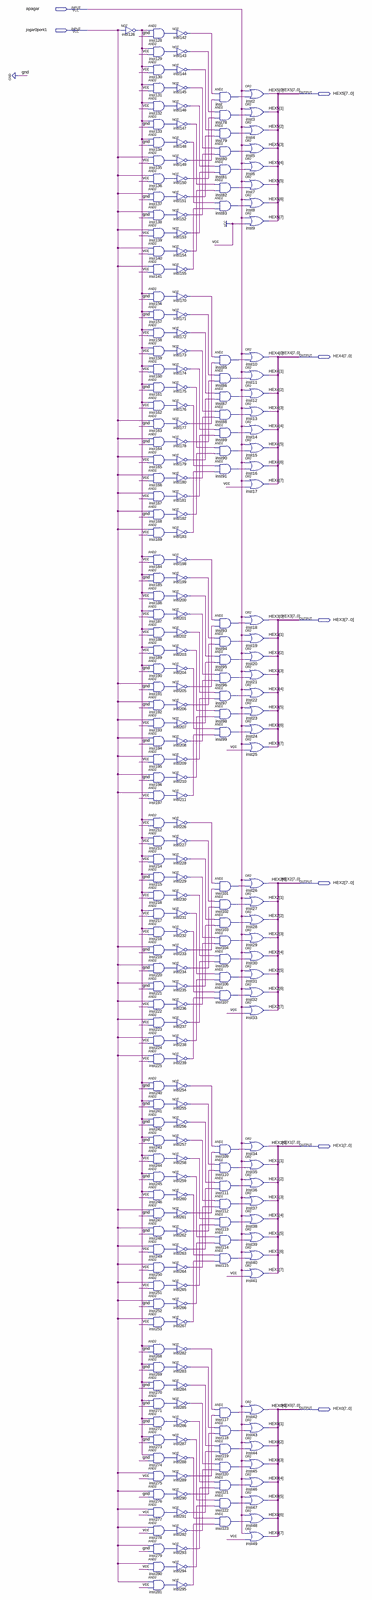
[diagram p0: schematic sheet, whole]
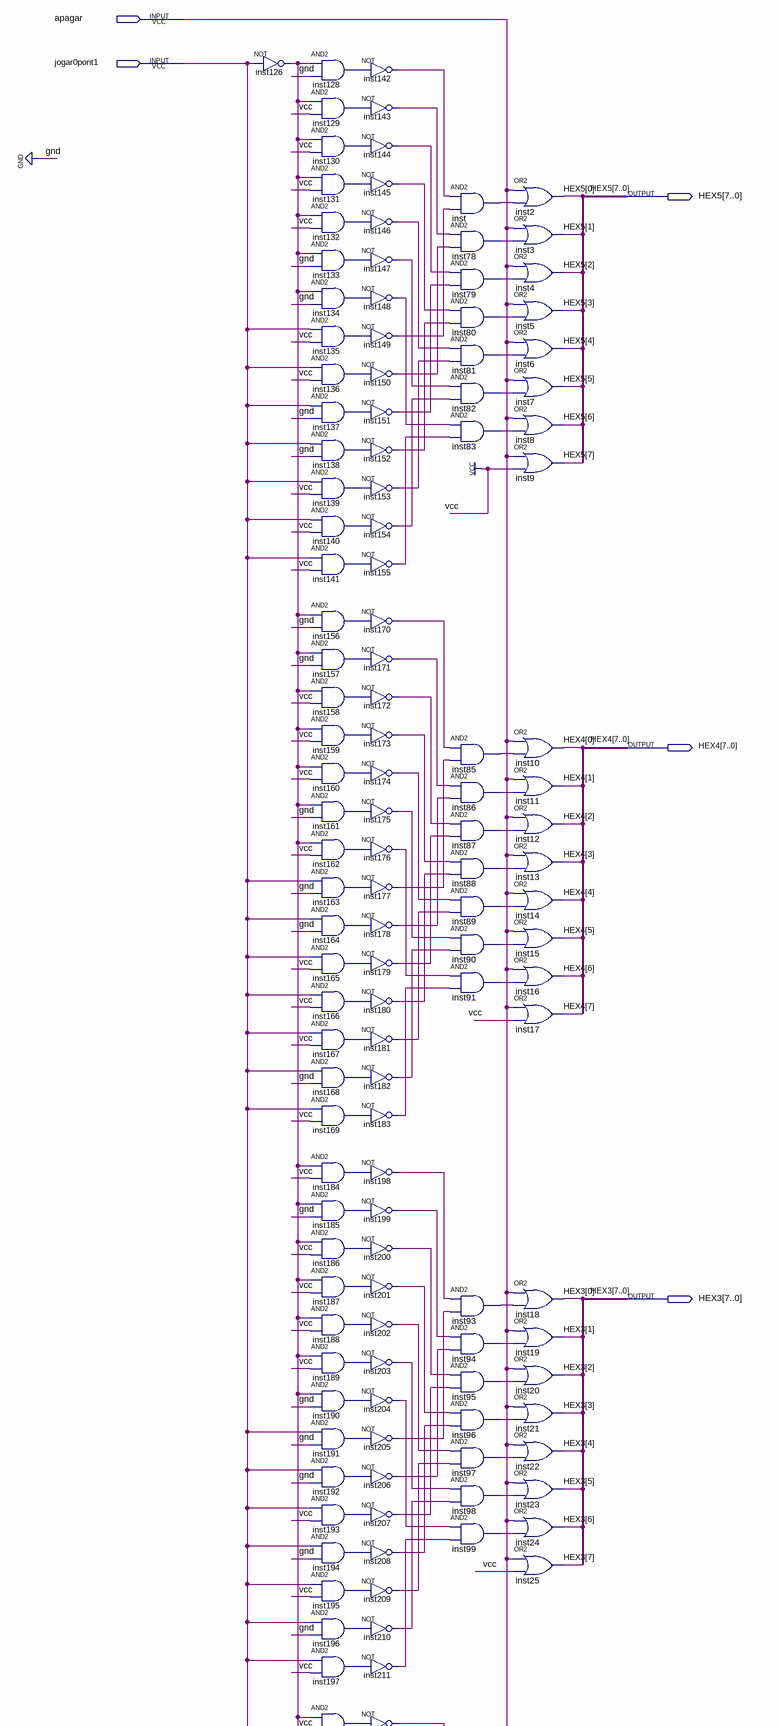
[diagram p1: schematic sheet, upper part]
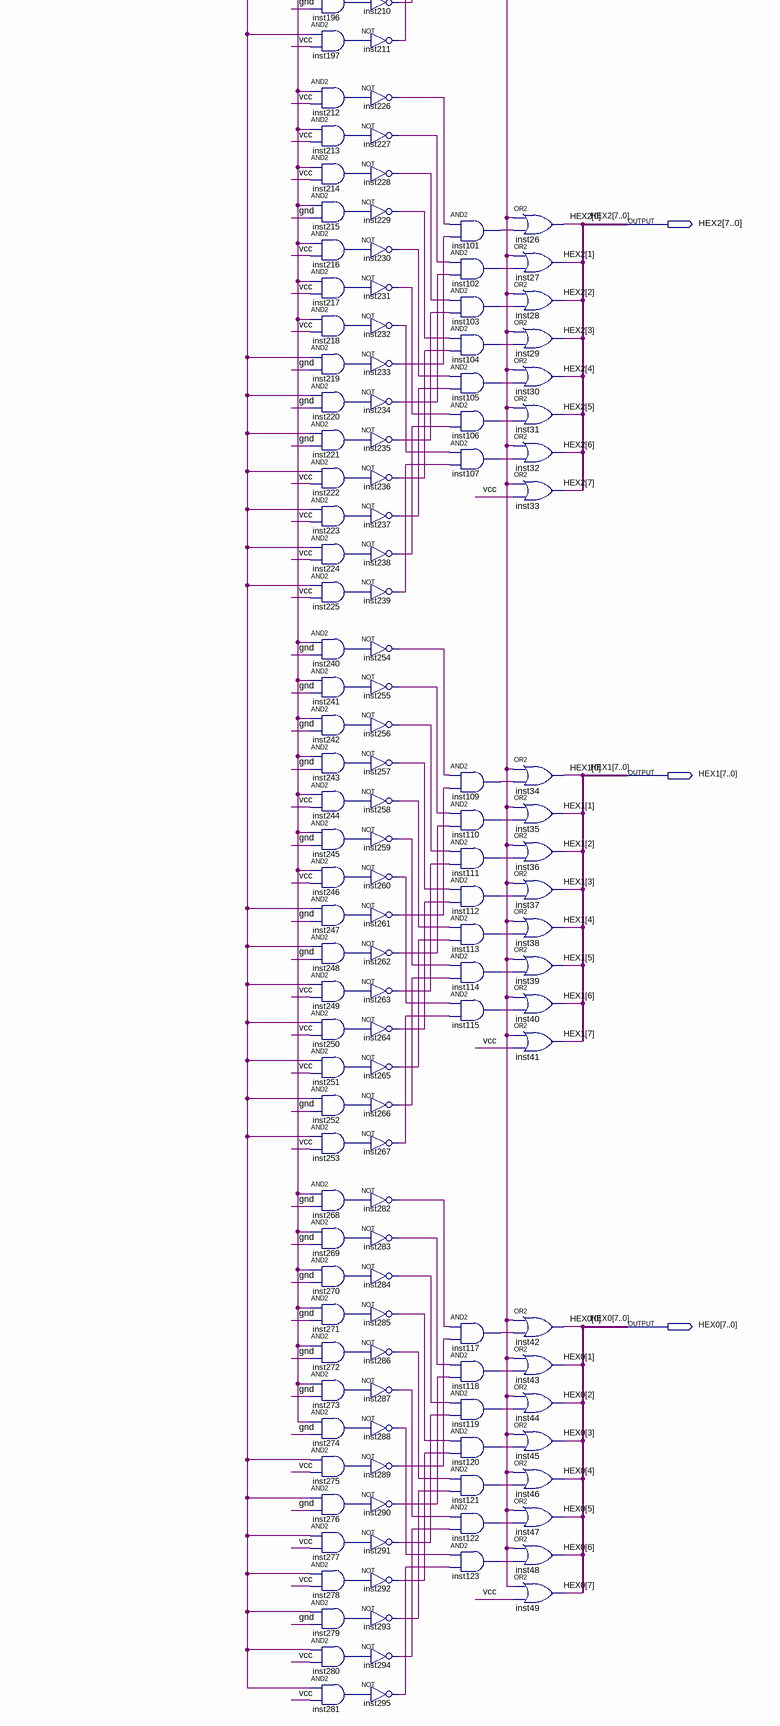
[diagram p2: schematic sheet, lower part]
// Quartus schematic displaymenu.bdf as structural Verilog: 259 symbols, 8 pins
module displaymenu (
  input  apagar,
  input  jogar0pont1,
  output [7:0] HEX5,
  output [7:0] HEX4,
  output [7:0] HEX3,
  output [7:0] HEX2,
  output [7:0] HEX1,
  output [7:0] HEX0
);

  wire inst78_out, inst79_out, inst80_out, inst81_out, inst82_out, inst83_out, inst85_out, inst86_out,
       inst87_out, inst88_out, inst89_out, inst90_out, inst91_out, inst93_out, inst94_out, inst95_out,
       inst96_out, inst97_out, inst98_out, inst99_out, inst101_out, inst102_out, inst103_out, inst104_out,
       inst105_out, inst106_out, inst107_out, inst109_out, inst110_out, inst111_out, inst112_out,
       inst113_out, inst114_out, inst115_out, inst117_out, inst118_out, inst119_out, inst120_out,
       inst121_out, inst122_out, inst123_out, inst126_out, inst128_out, inst129_out, inst130_out,
       inst131_out, inst132_out, inst133_out, inst134_out, inst135_out, inst136_out, inst137_out,
       inst138_out, inst139_out, inst140_out, inst141_out, inst142_out, inst143_out, inst144_out,
       inst145_out, inst146_out, inst147_out, inst148_out, inst149_out, inst150_out, inst151_out,
       inst152_out, inst153_out, inst154_out, inst155_out, inst156_out, inst157_out, inst158_out,
       inst159_out, inst160_out, inst161_out, inst162_out, inst163_out, inst164_out, inst165_out,
       inst166_out, inst167_out, inst168_out, inst169_out, inst170_out, inst171_out, inst172_out,
       inst173_out, inst174_out, inst175_out, inst176_out, inst177_out, inst178_out, inst179_out,
       inst180_out, inst181_out, inst182_out, inst183_out, inst184_out, inst185_out, inst186_out,
       inst187_out, inst188_out, inst189_out, inst190_out, inst191_out, inst192_out, inst193_out,
       inst194_out, inst195_out, inst196_out, inst197_out, inst198_out, inst199_out, inst200_out,
       inst201_out, inst202_out, inst203_out, inst204_out, inst205_out, inst206_out, inst207_out,
       inst208_out, inst209_out, inst210_out, inst211_out, inst212_out, inst213_out, inst214_out,
       inst215_out, inst216_out, inst217_out, inst218_out, inst219_out, inst220_out, inst221_out,
       inst222_out, inst223_out, inst224_out, inst225_out, inst226_out, inst227_out, inst228_out,
       inst229_out, inst230_out, inst231_out, inst232_out, inst233_out, inst234_out, inst235_out,
       inst236_out, inst237_out, inst238_out, inst239_out, inst240_out, inst241_out, inst242_out,
       inst243_out, inst244_out, inst245_out, inst246_out, inst247_out, inst248_out, inst249_out,
       inst250_out, inst251_out, inst252_out, inst253_out, inst254_out, inst255_out, inst256_out,
       inst257_out, inst258_out, inst259_out, inst260_out, inst261_out, inst262_out, inst263_out,
       inst264_out, inst265_out, inst266_out, inst267_out, inst268_out, inst269_out, inst270_out,
       inst271_out, inst272_out, inst273_out, inst274_out, inst275_out, inst276_out, inst277_out,
       inst278_out, inst279_out, inst280_out, inst281_out, inst282_out, inst283_out, inst284_out,
       inst285_out, inst286_out, inst287_out, inst288_out, inst289_out, inst290_out, inst291_out,
       inst292_out, inst293_out, inst294_out, inst295_out, inst_out;

  not inst126 (inst126_out, jogar0pont1);
  and inst128 (inst128_out, inst126_out, 1'b0);
  and inst129 (inst129_out, inst126_out, 1'b1);
  and inst130 (inst130_out, inst126_out, 1'b1);
  and inst131 (inst131_out, inst126_out, 1'b1);
  and inst132 (inst132_out, inst126_out, 1'b1);
  and inst133 (inst133_out, inst126_out, 1'b0);
  and inst134 (inst134_out, inst126_out, 1'b0);
  and inst135 (inst135_out, jogar0pont1, 1'b1);
  and inst136 (inst136_out, jogar0pont1, 1'b1);
  and inst137 (inst137_out, jogar0pont1, 1'b0);
  and inst138 (inst138_out, jogar0pont1, 1'b0);
  and inst139 (inst139_out, jogar0pont1, 1'b1);
  and inst140 (inst140_out, jogar0pont1, 1'b1);
  and inst141 (inst141_out, jogar0pont1, 1'b1);
  and inst156 (inst156_out, inst126_out, 1'b0);
  and inst157 (inst157_out, inst126_out, 1'b0);
  and inst158 (inst158_out, inst126_out, 1'b1);
  and inst159 (inst159_out, inst126_out, 1'b1);
  and inst160 (inst160_out, inst126_out, 1'b1);
  and inst161 (inst161_out, inst126_out, 1'b0);
  and inst162 (inst162_out, inst126_out, 1'b1);
  and inst163 (inst163_out, jogar0pont1, 1'b0);
  and inst164 (inst164_out, jogar0pont1, 1'b0);
  and inst165 (inst165_out, jogar0pont1, 1'b1);
  and inst166 (inst166_out, jogar0pont1, 1'b1);
  and inst167 (inst167_out, jogar0pont1, 1'b1);
  and inst168 (inst168_out, jogar0pont1, 1'b0);
  and inst169 (inst169_out, jogar0pont1, 1'b1);
  and inst184 (inst184_out, inst126_out, 1'b1);
  and inst185 (inst185_out, inst126_out, 1'b0);
  and inst186 (inst186_out, inst126_out, 1'b1);
  and inst187 (inst187_out, inst126_out, 1'b1);
  and inst188 (inst188_out, inst126_out, 1'b1);
  and inst189 (inst189_out, inst126_out, 1'b1);
  and inst190 (inst190_out, inst126_out, 1'b0);
  and inst191 (inst191_out, jogar0pont1, 1'b0);
  and inst192 (inst192_out, jogar0pont1, 1'b0);
  and inst193 (inst193_out, jogar0pont1, 1'b1);
  and inst194 (inst194_out, jogar0pont1, 1'b0);
  and inst195 (inst195_out, jogar0pont1, 1'b1);
  and inst196 (inst196_out, jogar0pont1, 1'b0);
  and inst197 (inst197_out, jogar0pont1, 1'b1);
  and inst212 (inst212_out, inst126_out, 1'b1);
  and inst213 (inst213_out, inst126_out, 1'b1);
  and inst214 (inst214_out, inst126_out, 1'b1);
  and inst215 (inst215_out, inst126_out, 1'b0);
  and inst216 (inst216_out, inst126_out, 1'b1);
  and inst217 (inst217_out, inst126_out, 1'b1);
  and inst218 (inst218_out, inst126_out, 1'b1);
  and inst219 (inst219_out, jogar0pont1, 1'b0);
  and inst220 (inst220_out, jogar0pont1, 1'b0);
  and inst221 (inst221_out, jogar0pont1, 1'b0);
  and inst222 (inst222_out, jogar0pont1, 1'b1);
  and inst223 (inst223_out, jogar0pont1, 1'b1);
  and inst224 (inst224_out, jogar0pont1, 1'b1);
  and inst225 (inst225_out, jogar0pont1, 1'b1);
  and inst240 (inst240_out, inst126_out, 1'b0);
  and inst241 (inst241_out, inst126_out, 1'b0);
  and inst242 (inst242_out, inst126_out, 1'b0);
  and inst243 (inst243_out, inst126_out, 1'b0);
  and inst244 (inst244_out, inst126_out, 1'b1);
  and inst245 (inst245_out, inst126_out, 1'b0);
  and inst246 (inst246_out, inst126_out, 1'b1);
  and inst247 (inst247_out, jogar0pont1, 1'b0);
  and inst248 (inst248_out, jogar0pont1, 1'b0);
  and inst249 (inst249_out, jogar0pont1, 1'b1);
  and inst250 (inst250_out, jogar0pont1, 1'b1);
  and inst251 (inst251_out, jogar0pont1, 1'b1);
  and inst252 (inst252_out, jogar0pont1, 1'b0);
  and inst253 (inst253_out, jogar0pont1, 1'b1);
  and inst268 (inst268_out, inst126_out, 1'b0);
  and inst269 (inst269_out, inst126_out, 1'b0);
  and inst270 (inst270_out, inst126_out, 1'b0);
  and inst271 (inst271_out, inst126_out, 1'b0);
  and inst272 (inst272_out, inst126_out, 1'b0);
  and inst273 (inst273_out, inst126_out, 1'b0);
  and inst274 (inst274_out, inst126_out, 1'b0);
  and inst275 (inst275_out, jogar0pont1, 1'b1);
  and inst276 (inst276_out, jogar0pont1, 1'b0);
  and inst277 (inst277_out, jogar0pont1, 1'b1);
  and inst278 (inst278_out, jogar0pont1, 1'b1);
  and inst279 (inst279_out, jogar0pont1, 1'b0);
  and inst280 (inst280_out, jogar0pont1, 1'b1);
  and inst281 (inst281_out, jogar0pont1, 1'b1);
  not inst142 (inst142_out, inst128_out);
  not inst143 (inst143_out, inst129_out);
  not inst144 (inst144_out, inst130_out);
  not inst145 (inst145_out, inst131_out);
  not inst146 (inst146_out, inst132_out);
  not inst147 (inst147_out, inst133_out);
  not inst148 (inst148_out, inst134_out);
  not inst149 (inst149_out, inst135_out);
  not inst150 (inst150_out, inst136_out);
  not inst151 (inst151_out, inst137_out);
  not inst152 (inst152_out, inst138_out);
  not inst153 (inst153_out, inst139_out);
  not inst154 (inst154_out, inst140_out);
  not inst155 (inst155_out, inst141_out);
  not inst170 (inst170_out, inst156_out);
  not inst171 (inst171_out, inst157_out);
  not inst172 (inst172_out, inst158_out);
  not inst173 (inst173_out, inst159_out);
  not inst174 (inst174_out, inst160_out);
  not inst175 (inst175_out, inst161_out);
  not inst176 (inst176_out, inst162_out);
  not inst177 (inst177_out, inst163_out);
  not inst178 (inst178_out, inst164_out);
  not inst179 (inst179_out, inst165_out);
  not inst180 (inst180_out, inst166_out);
  not inst181 (inst181_out, inst167_out);
  not inst182 (inst182_out, inst168_out);
  not inst183 (inst183_out, inst169_out);
  not inst198 (inst198_out, inst184_out);
  not inst199 (inst199_out, inst185_out);
  not inst200 (inst200_out, inst186_out);
  not inst201 (inst201_out, inst187_out);
  not inst202 (inst202_out, inst188_out);
  not inst203 (inst203_out, inst189_out);
  not inst204 (inst204_out, inst190_out);
  not inst205 (inst205_out, inst191_out);
  not inst206 (inst206_out, inst192_out);
  not inst207 (inst207_out, inst193_out);
  not inst208 (inst208_out, inst194_out);
  not inst209 (inst209_out, inst195_out);
  not inst210 (inst210_out, inst196_out);
  not inst211 (inst211_out, inst197_out);
  not inst226 (inst226_out, inst212_out);
  not inst227 (inst227_out, inst213_out);
  not inst228 (inst228_out, inst214_out);
  not inst229 (inst229_out, inst215_out);
  not inst230 (inst230_out, inst216_out);
  not inst231 (inst231_out, inst217_out);
  not inst232 (inst232_out, inst218_out);
  not inst233 (inst233_out, inst219_out);
  not inst234 (inst234_out, inst220_out);
  not inst235 (inst235_out, inst221_out);
  not inst236 (inst236_out, inst222_out);
  not inst237 (inst237_out, inst223_out);
  not inst238 (inst238_out, inst224_out);
  not inst239 (inst239_out, inst225_out);
  not inst254 (inst254_out, inst240_out);
  not inst255 (inst255_out, inst241_out);
  not inst256 (inst256_out, inst242_out);
  not inst257 (inst257_out, inst243_out);
  not inst258 (inst258_out, inst244_out);
  not inst259 (inst259_out, inst245_out);
  not inst260 (inst260_out, inst246_out);
  not inst261 (inst261_out, inst247_out);
  not inst262 (inst262_out, inst248_out);
  not inst263 (inst263_out, inst249_out);
  not inst264 (inst264_out, inst250_out);
  not inst265 (inst265_out, inst251_out);
  not inst266 (inst266_out, inst252_out);
  not inst267 (inst267_out, inst253_out);
  not inst282 (inst282_out, inst268_out);
  not inst283 (inst283_out, inst269_out);
  not inst284 (inst284_out, inst270_out);
  not inst285 (inst285_out, inst271_out);
  not inst286 (inst286_out, inst272_out);
  not inst287 (inst287_out, inst273_out);
  not inst288 (inst288_out, inst274_out);
  not inst289 (inst289_out, inst275_out);
  not inst290 (inst290_out, inst276_out);
  not inst291 (inst291_out, inst277_out);
  not inst292 (inst292_out, inst278_out);
  not inst293 (inst293_out, inst279_out);
  not inst294 (inst294_out, inst280_out);
  not inst295 (inst295_out, inst281_out);
  and inst (inst_out, inst142_out, inst149_out);
  and inst78 (inst78_out, inst143_out, inst150_out);
  and inst79 (inst79_out, inst144_out, inst151_out);
  and inst80 (inst80_out, inst145_out, inst152_out);
  and inst81 (inst81_out, inst146_out, inst153_out);
  and inst82 (inst82_out, inst147_out, inst154_out);
  and inst83 (inst83_out, inst148_out, inst155_out);
  and inst85 (inst85_out, inst170_out, inst177_out);
  and inst86 (inst86_out, inst171_out, inst178_out);
  and inst87 (inst87_out, inst172_out, inst179_out);
  and inst88 (inst88_out, inst173_out, inst180_out);
  and inst89 (inst89_out, inst174_out, inst181_out);
  and inst90 (inst90_out, inst175_out, inst182_out);
  and inst91 (inst91_out, inst176_out, inst183_out);
  and inst93 (inst93_out, inst198_out, inst205_out);
  and inst94 (inst94_out, inst199_out, inst206_out);
  and inst95 (inst95_out, inst200_out, inst207_out);
  and inst96 (inst96_out, inst201_out, inst208_out);
  and inst97 (inst97_out, inst202_out, inst209_out);
  and inst98 (inst98_out, inst203_out, inst210_out);
  and inst99 (inst99_out, inst204_out, inst211_out);
  and inst101 (inst101_out, inst226_out, inst233_out);
  and inst102 (inst102_out, inst227_out, inst234_out);
  and inst103 (inst103_out, inst228_out, inst235_out);
  and inst104 (inst104_out, inst229_out, inst236_out);
  and inst105 (inst105_out, inst230_out, inst237_out);
  and inst106 (inst106_out, inst231_out, inst238_out);
  and inst107 (inst107_out, inst232_out, inst239_out);
  and inst109 (inst109_out, inst254_out, inst261_out);
  and inst110 (inst110_out, inst255_out, inst262_out);
  and inst111 (inst111_out, inst256_out, inst263_out);
  and inst112 (inst112_out, inst257_out, inst264_out);
  and inst113 (inst113_out, inst258_out, inst265_out);
  and inst114 (inst114_out, inst259_out, inst266_out);
  and inst115 (inst115_out, inst260_out, inst267_out);
  and inst117 (inst117_out, inst282_out, inst289_out);
  and inst118 (inst118_out, inst283_out, inst290_out);
  and inst119 (inst119_out, inst284_out, inst291_out);
  and inst120 (inst120_out, inst285_out, inst292_out);
  and inst121 (inst121_out, inst286_out, inst293_out);
  and inst122 (inst122_out, inst287_out, inst294_out);
  and inst123 (inst123_out, inst288_out, inst295_out);
  or inst2 (HEX5[0], apagar, inst_out);
  or inst3 (HEX5[1], apagar, inst78_out);
  or inst4 (HEX5[2], apagar, inst79_out);
  or inst5 (HEX5[3], apagar, inst80_out);
  or inst6 (HEX5[4], apagar, inst81_out);
  or inst7 (HEX5[5], apagar, inst82_out);
  or inst8 (HEX5[6], apagar, inst83_out);
  or inst9 (HEX5[7], apagar, 1'b1);
  or inst10 (HEX4[0], apagar, inst85_out);
  or inst11 (HEX4[1], apagar, inst86_out);
  or inst12 (HEX4[2], apagar, inst87_out);
  or inst13 (HEX4[3], apagar, inst88_out);
  or inst14 (HEX4[4], apagar, inst89_out);
  or inst15 (HEX4[5], apagar, inst90_out);
  or inst16 (HEX4[6], apagar, inst91_out);
  or inst17 (HEX4[7], apagar, 1'b1);
  or inst18 (HEX3[0], apagar, inst93_out);
  or inst19 (HEX3[1], apagar, inst94_out);
  or inst20 (HEX3[2], apagar, inst95_out);
  or inst21 (HEX3[3], apagar, inst96_out);
  or inst22 (HEX3[4], apagar, inst97_out);
  or inst23 (HEX3[5], apagar, inst98_out);
  or inst24 (HEX3[6], apagar, inst99_out);
  or inst25 (HEX3[7], apagar, 1'b1);
  or inst26 (HEX2[0], apagar, inst101_out);
  or inst27 (HEX2[1], apagar, inst102_out);
  or inst28 (HEX2[2], apagar, inst103_out);
  or inst29 (HEX2[3], apagar, inst104_out);
  or inst30 (HEX2[4], apagar, inst105_out);
  or inst31 (HEX2[5], apagar, inst106_out);
  or inst32 (HEX2[6], apagar, inst107_out);
  or inst33 (HEX2[7], apagar, 1'b1);
  or inst34 (HEX1[0], apagar, inst109_out);
  or inst35 (HEX1[1], apagar, inst110_out);
  or inst36 (HEX1[2], apagar, inst111_out);
  or inst37 (HEX1[3], apagar, inst112_out);
  or inst38 (HEX1[4], apagar, inst113_out);
  or inst39 (HEX1[5], apagar, inst114_out);
  or inst40 (HEX1[6], apagar, inst115_out);
  or inst41 (HEX1[7], apagar, 1'b1);
  or inst42 (HEX0[0], apagar, inst117_out);
  or inst43 (HEX0[1], apagar, inst118_out);
  or inst44 (HEX0[2], apagar, inst119_out);
  or inst45 (HEX0[3], apagar, inst120_out);
  or inst46 (HEX0[4], apagar, inst121_out);
  or inst47 (HEX0[5], apagar, inst122_out);
  or inst48 (HEX0[6], apagar, inst123_out);
  or inst49 (HEX0[7], apagar, 1'b1);

  // Notes on the sheet:
  //   vcc
endmodule
